# Altium schematic sheet Sheet3.SchDoc
size A4; SheetNumber: 3; SheetTotal: 3
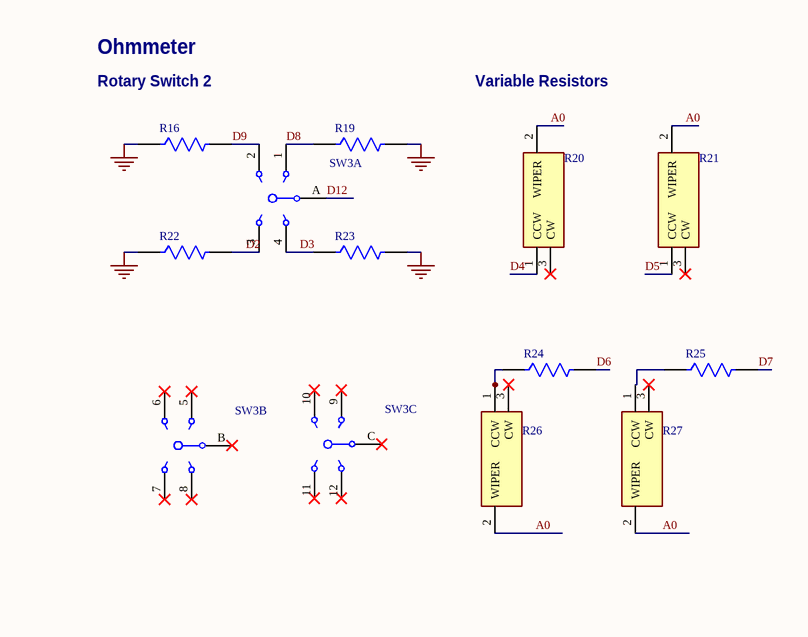
[diagram p0: Sheet3.SchDoc, top right]
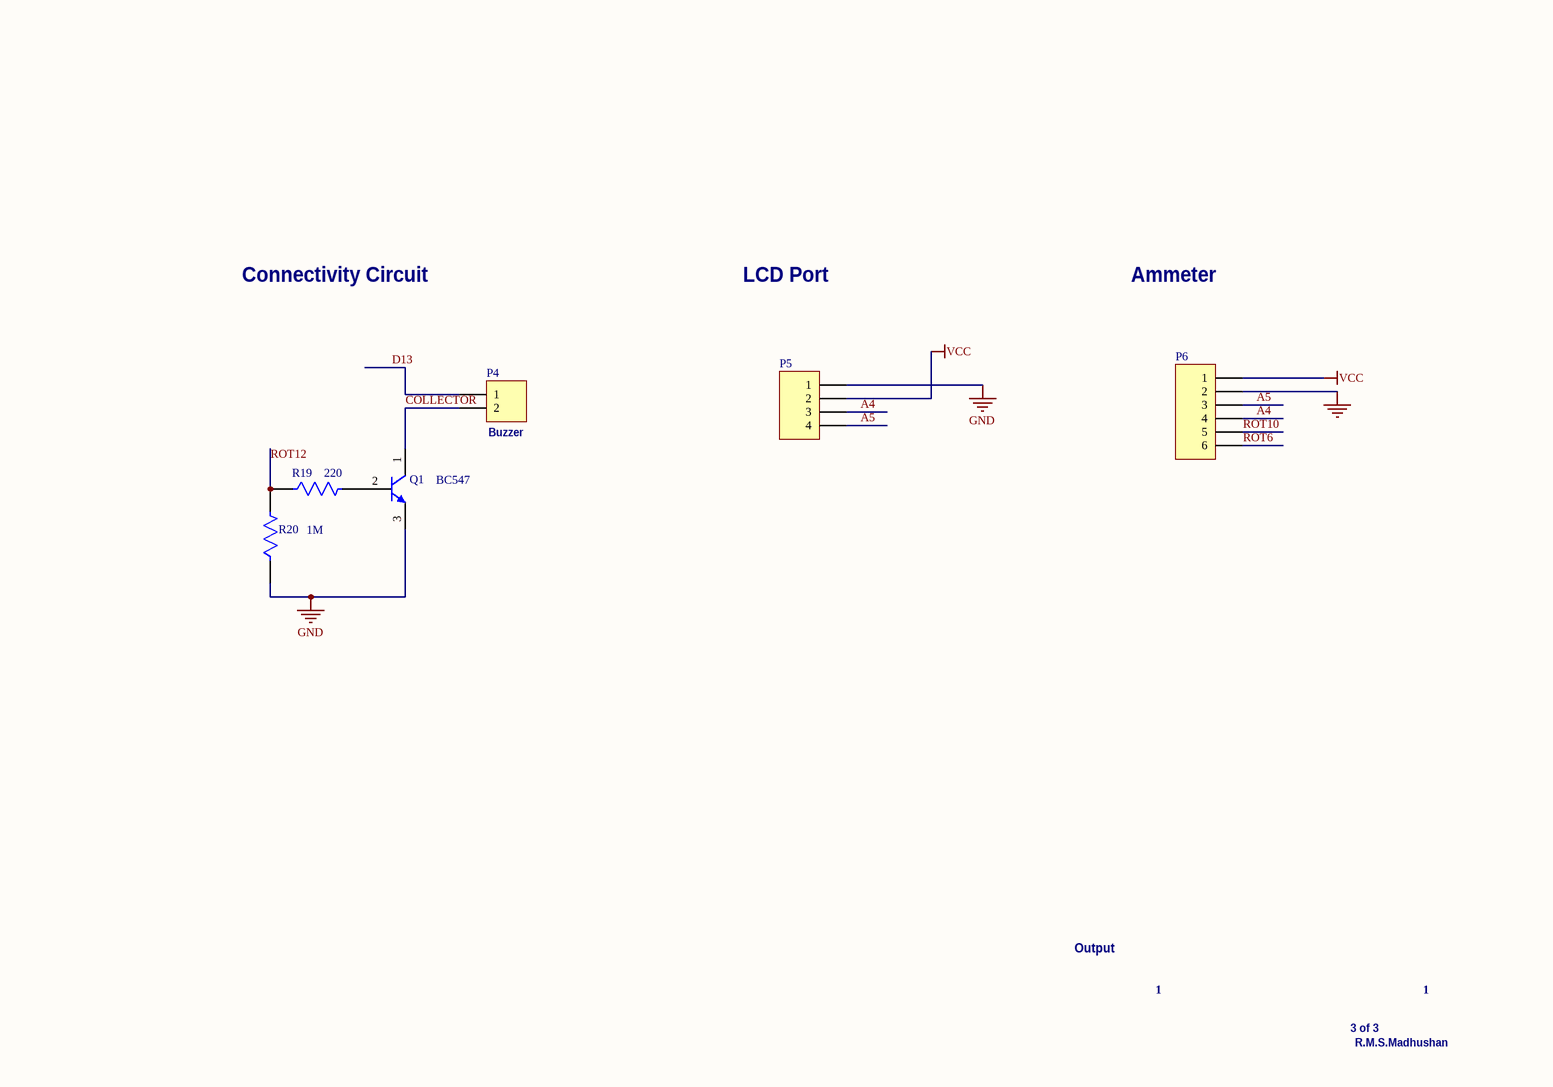
[diagram p1: Sheet3.SchDoc, bottom left]

## Parts
(Parts that share a designator on the sheet are numbered #1, #2 ... from top to bottom, then left to right.)
P4  Header 2  [MY_FE02W]  (value not drawn)
P5  Header 4  [MY_FE04W]  (value not drawn)
P6  Header 6  [MY_FE06W]  (value not drawn)
Q1  BC547  [ONSC-TO-92-3-29-11_AM_BL]
R16  G001R1000FE1280  [FP-G001R1000FE1280-MFG]  (value not drawn)
R19#1  G001R1000FE1280  [FP-G001R1000FE1280-MFG]  (value not drawn)
R19#2  220  [FP-G001R1000FE1280-MFG]
R20#1  3362P-1-203LF  [3362P_1]  (value not drawn)
R20#2  1M  [FP-G001R1000FE1280-MFG]
R21  3362P-1-203LF  [3362P_1]  (value not drawn)
R22  G001R1000FE1280  [FP-G001R1000FE1280-MFG]  (value not drawn)
R23  G001R1000FE1280  [FP-G001R1000FE1280-MFG]  (value not drawn)
R24  G001R1000FE1280  [FP-G001R1000FE1280-MFG]  (value not drawn)
R25  G001R1000FE1280  [FP-G001R1000FE1280-MFG]  (value not drawn)
R26  3362P-1-203LF  [3362P_1]  (value not drawn)
R27  3362P-1-203LF  [3362P_1]  (value not drawn)
SW3  A30403RNZQ  [CKCP-A30403RNZQ-15_V]  (value not drawn)  (parts A,B,C of 3)

## Nets
GND: P5.1 P6.2 Q1.3(E) R16.1 R19#1.2 R20#2.1 R22.1 R23.2
VCC: P5.2 P6.1
A0: R20#1.2(WIPER) R21.2(WIPER) R26.2(WIPER) R27.2(WIPER)
A4: P5.3 P6.4
A5: P5.4 P6.3
COLLECTOR: P4.2 Q1.1(C)
D2: R22.2 SW3.3
D3: R23.1 SW3.4
D4: R20#1.1(CCW)
D5: R21.1(CCW)
D6: R24.2
D7: R25.2
D8: R19#1.1 SW3.1
D9: R16.2 SW3.2
D12: SW3.A
D13: P4.1
ROT6: P6.6
ROT10: P6.5
ROT12: R19#2.1 R20#2.2
NetQ1_2: Q1.2(B) R19#2.2
NetR24_1: R24.1 R26.1(CCW)
NetR25_1: R25.1 R27.1(CCW)

Not connected (* = marked no-connect by the designer): R20#1 3(CW)*; R21 3(CW)*; R26 3(CW)*; R27 3(CW)*; SW3 5* 6* 7* 8* 9* 10* 11* 12* B* C*

## Notes on the sheet
- Ohmmeter
- (near R16) Rotary Switch 2
- Variable Resistors
- Connectivity Circuit
- LCD Port
- Ammeter
- (near P4) Buzzer
- Output
- 1
- 3 of 3
- R.M.S.Madhushan

## Library data of the parts
P4 = Header 2: Header, 2-Pin; ASiD Part Number: Header 2-AS
P5 = Header 4: Header, 4-Pin; ASiD Part Number: Header 4-AS
P6 = Header 6: Header, 6-Pin; ASiD Part Number: Header 6-AS
Q1 = CMP-1048-01605-1: Amplifier Transistor, NPN Silicon, 3-Pin TO-92, Pb-Free, Tape and Reel; Manufacturer: On Semiconductor; PartNumber: BC547BRL1G; IC Continuous (A): 0.1; fT Min (MHz): 150; ComponentLink2URL: http://www.onsemi.com/pub_link/Collateral/BC546-D.PDF; ComponentLink1URL: http://www.onsemi.com/; ComponentLink2Description: Datasheet; RoHS: TRUE; ComponentLink3Description: Package Specification; ComponentLink1Description: Manufacturer URL; ComponentLink3URL: http://www.onsemi.com/pub_link/Collateral/MAC97-D.PDF; PackageDescription: 3-Pin Transistor Outline, Body 4.825 x 3.685 mm, Pitch 1.27 mm; Packing: Tape and Reel; PackageVersion: Rev. AM; Polarity: NPN; DatasheetVersion: Rev. 7; Mounting Technology: Through Hole; PackageReference: TO-92-3-29-11_AM_BL
R16 R19#1 R19#2 R20#2 R22-R25 = CMP-02408-000025-1: Res Wirewound 0.1 Ohm 1% 1W ±90ppm/°C Ceramic Hi Temp Sil AXL Thru-Hole Bulk; Resistance: 100mR; Case/Package: Ceramic; Construction: Cylindrical; Diameter: 2.16mm; Series: G; Tolerance: 1%; Max Operating Temperature: 250°C; Lead Free: Lead Free; Resistor Type: Wirewound; Contact Plating: Tin; Mount: Through Hole; Radiation Hardening: No; RoHS Compliant: Yes; Termination: Axial; Temperature Coefficient: 90ppm/°C; Min Operating Temperature: -65°C; Length: 7.14mm; Military Standard: Not; Packaging: Tape and Reel; Power Rating: 1W
R20#1 R21 R26 R27 = 3362P-1-203LF: Resistor; Manufacturer_Name: Bourns; Datasheet Link: https://www.bourns.com/docs/Product-Datasheets/3362.pdf; Manufacturer_Part_Number: 3362P-1-203LF; Mouser Part Number: 652-3362P-1-203LF; Mouser Price/Stock: https://www.mouser.co.uk/ProductDetail/Bourns/3362P-1-203LF?qs=GslmPyR0hhF1JBua3W6Xbw%3D%3D; Arrow Part Number: 3362P-1-203LF; Arrow Price/Stock: https://www.arrow.com/en/products/3362p-1-203lf/bourns?region=europe
SW3 = CMP-1076-00008-1: A Series Rotary Switch, 3 Poles, 4 Positions, 30 deg Angle of Throw, -30 to 85 degC, RoHS; Manufacturer: C&K Components; Angle of Throw: 30 deg; Position: 4; Pole: 3; Series: A; Temperature Range: -30 to 85 degC; PackageDescription: 15-Pin Through Hole Device, Dia 26.19 mm, Height 32.02 mm; RoHS: TRUE; ComponentLink1URL: http://www.ck-components.com/; ComponentLink3Description: Package Specification; ComponentLink2Description: Datasheet; PartNumber: A30403RNZQ; DatasheetVersion: 41821; ComponentLink1Description: Manufacturer URL; Mounting Technology: Through Hole; PackageReference: A30403RNZQ-15; ComponentLink2URL: http://www.ck-components.com/13397/arotary_9apr14.pdf/; ComponentLink3URL: http://www.ck-components.com/13397/arotary_9apr14.pdf/